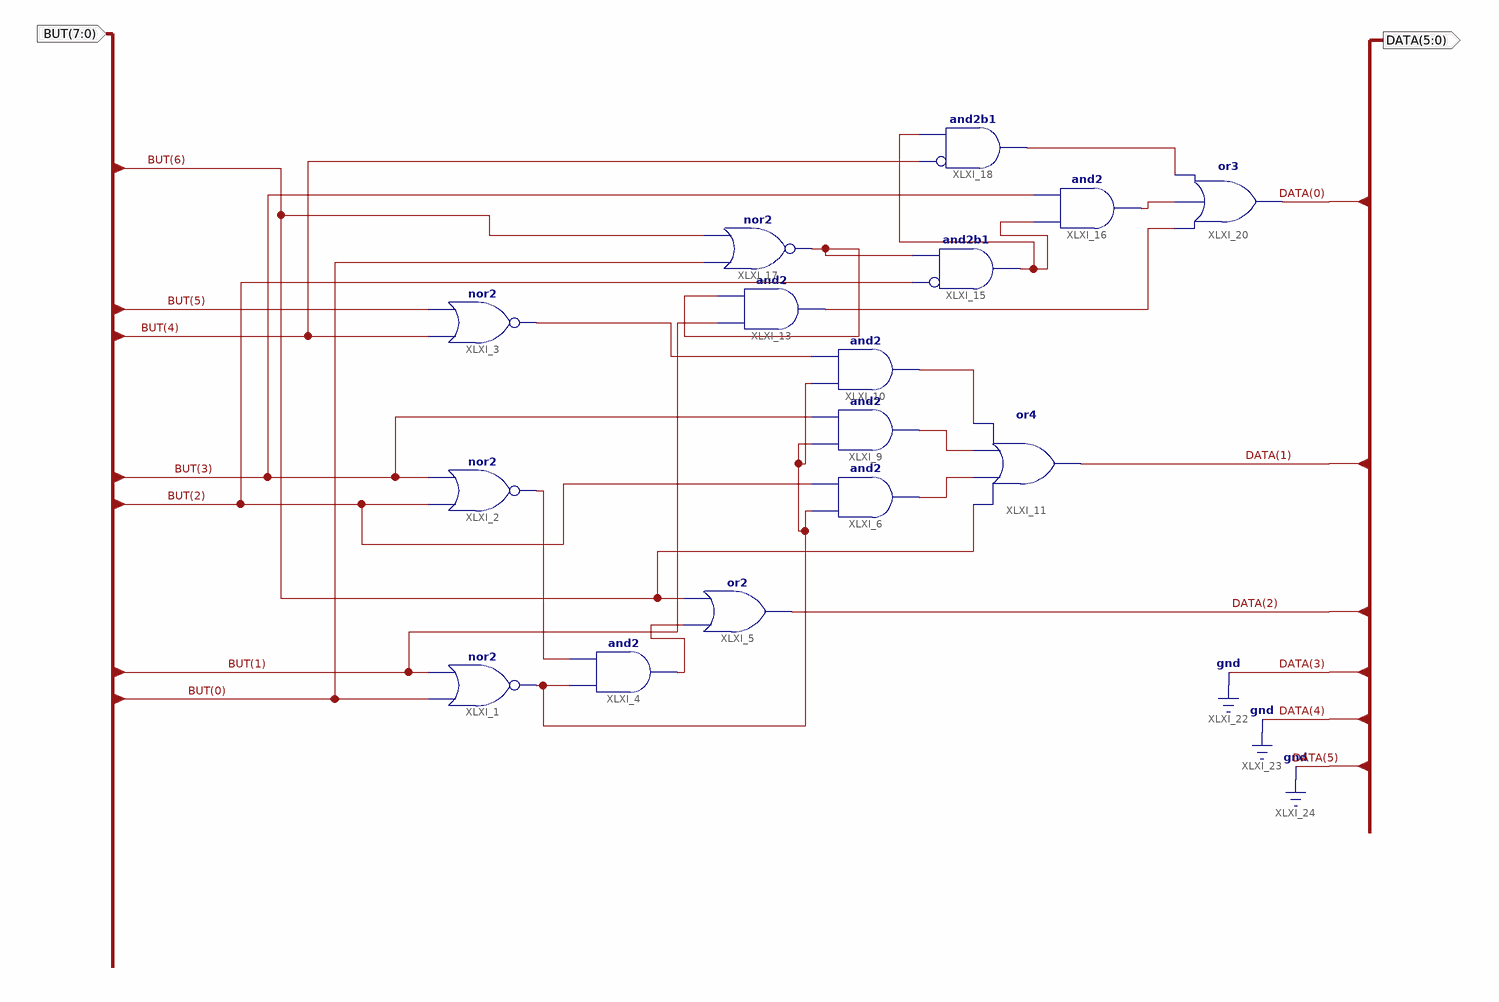
[diagram p0: schematic sheet 1]
// Xilinx ISE schematic ButtonEncoder.sch (xc9500xl) as structural Verilog: 15 symbols, 2 ports
module ButtonEncoder (
  input  [7:0] BUT,
  output [5:0] DATA
);

  wire XLXN_9, XLXN_10, XLXN_11, XLXN_19, XLXN_20, XLXN_21, XLXN_22, XLXN_30, XLXN_32, XLXN_34, XLXN_36,
       XLXN_37;

  nor XLXI_1 (XLXN_9, BUT[0], BUT[1]);
  nor XLXI_2 (XLXN_10, BUT[2], BUT[3]);
  nor XLXI_3 (XLXN_19, BUT[4], BUT[5]);
  and XLXI_4 (XLXN_11, XLXN_9, XLXN_10);
  or XLXI_5 (DATA[2], XLXN_11, BUT[6]);
  and XLXI_6 (XLXN_20, XLXN_9, BUT[2]);
  and XLXI_9 (XLXN_21, XLXN_9, BUT[3]);
  and XLXI_10 (XLXN_22, XLXN_9, XLXN_19);
  or XLXI_11 (DATA[1], BUT[6], XLXN_20, XLXN_21, XLXN_22);
  and XLXI_13 (XLXN_37, BUT[1], XLXN_30);
  and XLXI_15 (XLXN_32, ~BUT[2], XLXN_30);  // and2b1
  and XLXI_16 (XLXN_36, XLXN_32, BUT[3]);
  nor XLXI_17 (XLXN_30, BUT[0], BUT[6]);
  and XLXI_18 (XLXN_34, ~BUT[4], XLXN_32);  // and2b1
  or XLXI_20 (DATA[0], XLXN_37, XLXN_36, XLXN_34);

  assign DATA[5:3] = 3'b000;
endmodule
